# Altium schematic sheet USB2CAN.SchDoc: USB2CAN
size A4; ApprovedBy: Thanh Tùng; CheckedBy: Thanh Tùng; Author: Thanh Tùng; CompanyName: Vantix; DrawnBy: Thanh Tùng; Engineer: Thanh Tùng; Organization: Technopark; DocumentNumber: 1; Revision: V1.0; SheetNumber: 1; SheetTotal: 1
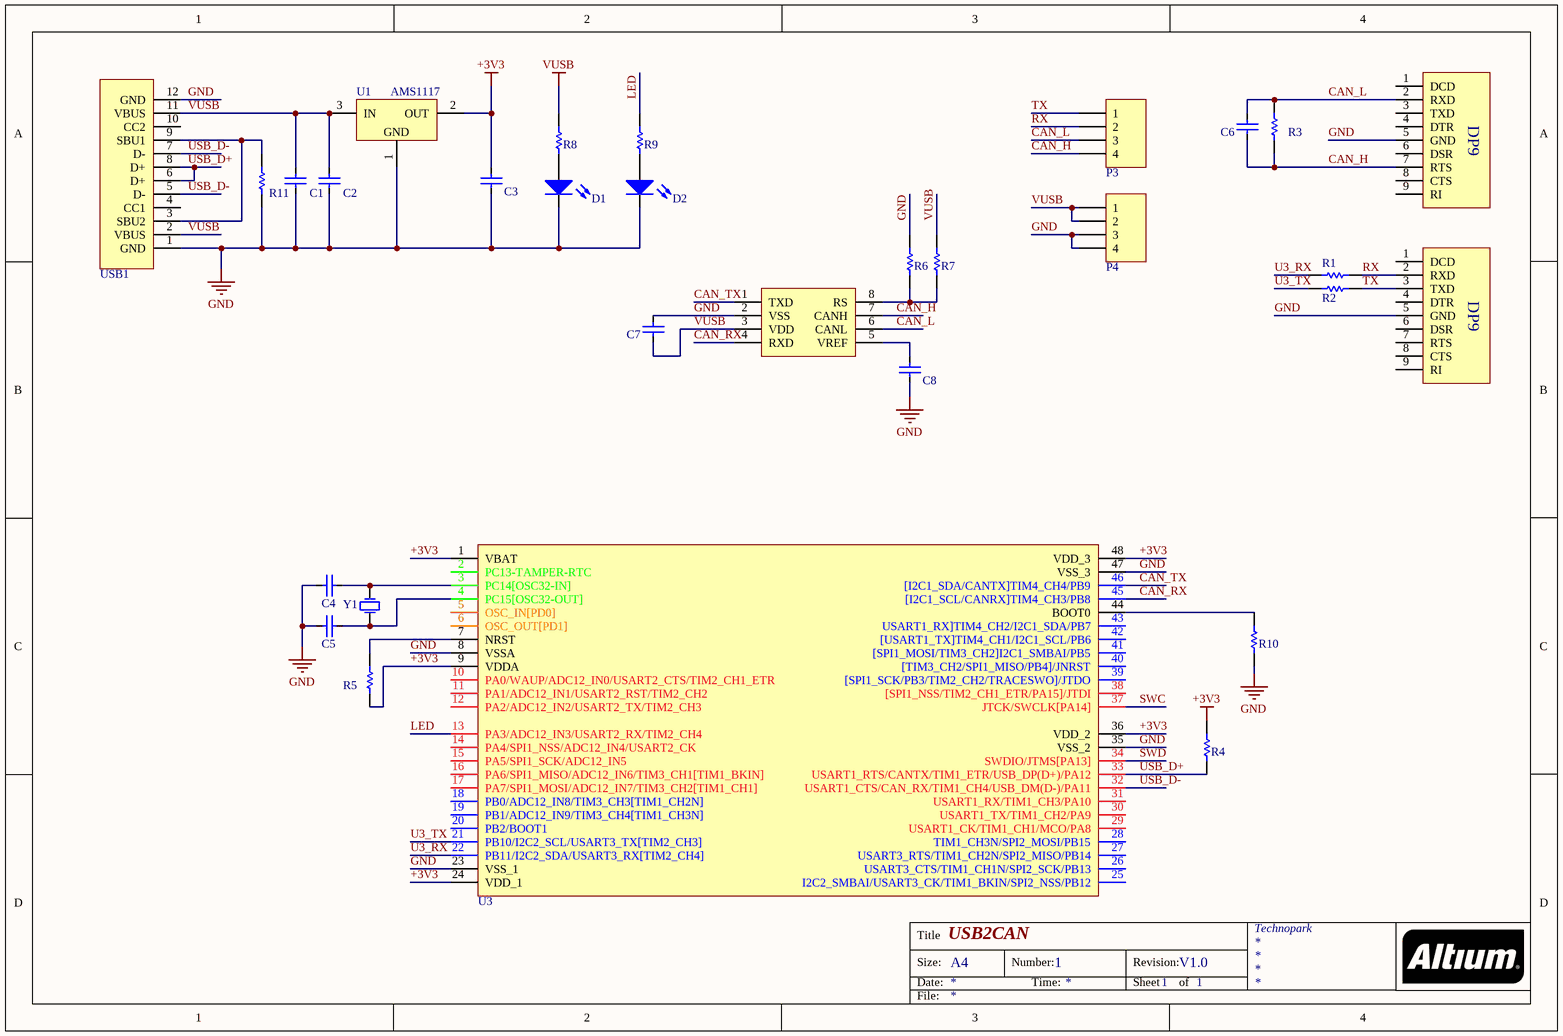
[diagram p0: USB2CAN.SchDoc]

## Parts
C1  CAP_NP  [C_0805]  (value not drawn)
C2  CAP_NP  [C_0805]  (value not drawn)
C3  CAP_NP  [C_0805]  (value not drawn)
C4  CAP_NP  [C_0603]  (value not drawn)
C5  CAP_NP  [C_0603]  (value not drawn)
C6  CAP_NP  [C_0603]  (value not drawn)
C7  CAP_NP  [C_0603]  (value not drawn)
C8  CAP_NP  [C_0603]  (value not drawn)
D1  LED  [LED-0603-R]  (value not drawn)
D2  LED  [LED-0603-G]  (value not drawn)
P1  DP9  [DR9T MALE]  (value not drawn)
P2  DP9  [DR9T MALE]  (value not drawn)
P3  HEADER 4  [JUMP 4]  (value not drawn)
P4  HEADER 4  [JUMP 4]  (value not drawn)
R1  R  [R_0603]  (value not drawn)
R2  R  [R_0603]  (value not drawn)
R3  R  [R_0603]  (value not drawn)
R4  R  [R_0603]  (value not drawn)
R5  R  [R_0603]  (value not drawn)
R6  R  [R_0603]  (value not drawn)
R7  R  [R_0603]  (value not drawn)
R8  R  [R_0603]  (value not drawn)
R9  R  [R_0603]  (value not drawn)
R10  R  [R_0603]  (value not drawn)
R11  R  [R_0603]  (value not drawn)
U1  AMS1117  [SOT 89]
U2  CAN TRANSEIVER  [SOP8]  (value not drawn)
U3  STM32F103C8T6  [LQFP-48]  (value not drawn)
USB1  USB C 16P  [USB C 16P]  (value not drawn)
Y1  12MHz  [CRYSTAL-3225]  (value not drawn)

## Nets
+3V3: C3.2 R4.2 R5.1 U1.2(OUT) U3.1(VBAT) U3.9(VDDA) U3.24(VDD_1) U3.36(VDD_2) U3.48(VDD_3)
GND: C1.1 C2.1 C3.1 C4.2 C5.2 C7.1 C8.2 D1.2(K) D2.2(K) P1.5(GND) P2.5(GND) P4.3 P4.4 R6.1 R10.1 R11.2 U1.1(GND) U2.2(VSS) U3.8(VSSA) U3.23(VSS_1) U3.35(VSS_2) U3.47(VSS_3) USB1.1(GND) USB1.12(GND)
VUSB: C1.2 C2.2 C7.2 P4.1 P4.2 R7.2 R8.1 U1.3(IN) U2.3(VDD) USB1.2(VBUS) USB1.11(VBUS)
CAN_H: C6.2 P1.7(RTS) P3.4 R3.1 U2.7(CANH)
CAN_L: C6.1 P1.2(RXD) P3.3 R3.2 U2.6(CANL)
CAN_RX: U2.4(RXD) U3.45([I2C1_SCL/CANRX]TIM4_CH3/PB8)
CAN_TX: U2.1(TXD) U3.46([I2C1_SDA/CANTX]TIM4_CH4/PB9)
LED: R9.1 U3.13(PA3/ADC12_IN3/USART2_RX/TIM2_CH4)
RX: P2.2(RXD) P3.2 R1.2
SWC: U3.37(JTCK/SWCLK[PA14])
SWD: U3.34(SWDIO/JTMS[PA13])
TX: P2.3(TXD) P3.1 R2.2
U3_RX: R1.1 U3.22(PB11/I2C2_SDA/USART3_RX[TIM2_CH4])
U3_TX: R2.1 U3.21(PB10/I2C2_SCL/USART3_TX[TIM2_CH3])
USB_D+: R4.1 U3.33(USART1_RTS/CANTX/TIM1_ETR/USB_DP(D+)/PA12) USB1.6(D+) USB1.8(D+)
USB_D-: U3.32(USART1_CTS/CAN_RX/TIM1_CH4/USB_DM(D-)/PA11) USB1.5(D-) USB1.7(D-)
NetC4_1: C4.1 U3.3(PC14[OSC32-IN]) Y1.3(OSC2)
NetC5_1: C5.1 U3.4(PC15[OSC32-OUT]) Y1.1(OSC1)
NetC8_1: C8.1 U2.5(VREF)
NetD1_1: D1.1(A) R8.2
NetD2_1: D2.1(A) R9.2
NetR5_2: R5.2 U3.7(NRST)
NetR6_2: R6.2 R7.1 U2.8(RS)
NetR10_2: R10.2 U3.44(BOOT0)
NetR11_1: R11.1 USB1.3(SBU2) USB1.9(SBU1)

Not connected (* = marked no-connect by the designer): P1 1(DCD) 3(TXD) 4(DTR) 6(DSR) 8(CTS) 9(RI); P2 1(DCD) 4(DTR) 6(DSR) 7(RTS) 8(CTS) 9(RI); U3 2(PC13-TAMPER-RTC) 5(OSC_IN[PD0]) 6(OSC_OUT[PD1]) 10(PA0/WAUP/ADC12_IN0/USART2_CTS/TIM2_CH1_ETR) 11(PA1/ADC12_IN1/USART2_RST/TIM2_CH2) 12(PA2/ADC12_IN2/USART2_TX/TIM2_CH3) 14(PA4/SPI1_NSS/ADC12_IN4/USART2_CK) 15(PA5/SPI1_SCK/ADC12_IN5) 16(PA6/SPI1_MISO/ADC12_IN6/TIM3_CH1[TIM1_BKIN]) 17(PA7/SPI1_MOSI/ADC12_IN7/TIM3_CH2[TIM1_CH1]) 18(PB0/ADC12_IN8/TIM3_CH3[TIM1_CH2N]) 19(PB1/ADC12_IN9/TIM3_CH4[TIM1_CH3N]) 20(PB2/BOOT1) 25(I2C2_SMBAI/USART3_CK/TIM1_BKIN/SPI2_NSS/PB12) 26(USART3_CTS/TIM1_CH1N/SPI2_SCK/PB13) 27(USART3_RTS/TIM1_CH2N/SPI2_MISO/PB14) 28(TIM1_CH3N/SPI2_MOSI/PB15) 29(USART1_CK/TIM1_CH1/MCO/PA8) 30(USART1_TX/TIM1_CH2/PA9) 31(USART1_RX/TIM1_CH3/PA10) 38([SPI1_NSS/TIM2_CH1_ETR/PA15]/JTDI) 39([SPI1_SCK/PB3/TIM2_CH2/TRACESWO]/JTDO) 40([TIM3_CH2/SPI1_MISO/PB4]/JNRST) 41([SPI1_MOSI/TIM3_CH2]I2C1_SMBAI/PB5) 42([USART1_TX]TIM4_CH1/I2C1_SCL/PB6) 43(USART1_RX]TIM4_CH2/I2C1_SDA/PB7); USB1 4(CC1) 10(CC2); Y1 2(OSC3) 4(OSC4)

## Notes on the sheet
- Title
- Size:
- Date:
- A4
- Number:
- Time:
- Revision:
- Sheet
- of
- File:

## Library data of the parts
D1 D2 = LED: Blue 465nm LED Indication - Discrete 3.8V 0603 (1608 Metric); Manufacturer: Everlight Electronics Co Ltd; Manufacturer Part Number: QTLP600CBTR; Lens Color: Colorless; Lens Transparency: Clear; Millicandela Rating: 20mcd; Lens Style/Size: Rectangle with Flat Top, 1.20mm x 0.80mm; Current - Test: 20mA; Viewing Angle: 100°; Wavelength - Peak: 430nm; Supplier 1: Digi-Key; RoHS: RoHS Compliant; Category: Optoelectronics; Stock 1: 2000; Pricing 1: 2000=0.23786, 6000=0.22937, 10000=0.22597 (USD); Packaging: Tape & Reel (TR); Part Status: Active; Color: Blue; Voltage - Forward (Vf) (Typ): 3.8V; Mounting Type: Surface Mount; Wavelength - Dominant: 465nm; Features: -; Package / Case: 0603 (1608 Metric); Supplier Device Package: *; Size / Dimension: 1.60mm L x 0.80mm W; Height (Max): 0.80mm; ComponentLink1URL: http://media.digikey.com/pdf/Data%20Sheets/Everlight%20PDFs/QTLP600C.pdf; ComponentLink1Description: http://media.digikey.com/pdf/Data%20Sheets/Everlight%20PDFs/QTLP600C.pdf; Supplier Part Number 1: 1080-1401-2-ND
R1-R11 = RESISTOR
U2 = MCP2551
U3 = STM32F103C8T6: MCU 32BIT 64KB FLASH 48LQFP;  ARM® Cortex®-M3 STM32 F1 Microcontroller IC 32-Bit 72MHz 64KB (64K x 8) FLASH; Manufacturer: STMicroelectronics; Connectivity: CAN, I²C, IrDA, LIN, SPI, UART/USART, USB; Peripherals: DMA, Motor Control PWM, PDR, POR, PVD, PWM, Temp Sensor, WDT; Number of I/O: 37; RAM Size: 20K x 8; Voltage - Supply (Vcc/Vdd): 2 V ~ 3.6 V; Data Converters: A/D 10x12b; Oscillator Type: Internal; Supplier 1: Digi-Key; Manufacturer Part Number: STM32F103C8T6; RoHS: RoHS Compliant; Category: Integrated Circuits (ICs); Stock 1: 3485; Pricing 1: 1=6.06, 10=5.438, 100=4.4558, 500=3.7931, 1000=3.199 (USD); Packaging: Tray; Part Status: Active; Core Processor: ARM® Cortex®-M3; Core Size: 32-Bit; Speed: 72MHz; Program Memory Size: 64KB (64K x 8); Program Memory Type: FLASH; EEPROM Size: -; Operating Temperature: -40°C ~ 85°C (TA); Package / Case: 48-LQFP; ComponentLink1URL: http://media.digikey.com/pdf/Data%20Sheets/ST%20Microelectronics%20PDFS/STM32F103x8,B.pdf; ComponentLink1Description: http://media.digikey.com/pdf/Data%20Sheets/ST%20Microelectronics%20PDFS/STM32F103x8,B.pdf; Supplier Part Number 1: 497-6063-ND
Y1 = CRYSTAL-3225